# Altium schematic sheet Processing.SchDoc
size A4
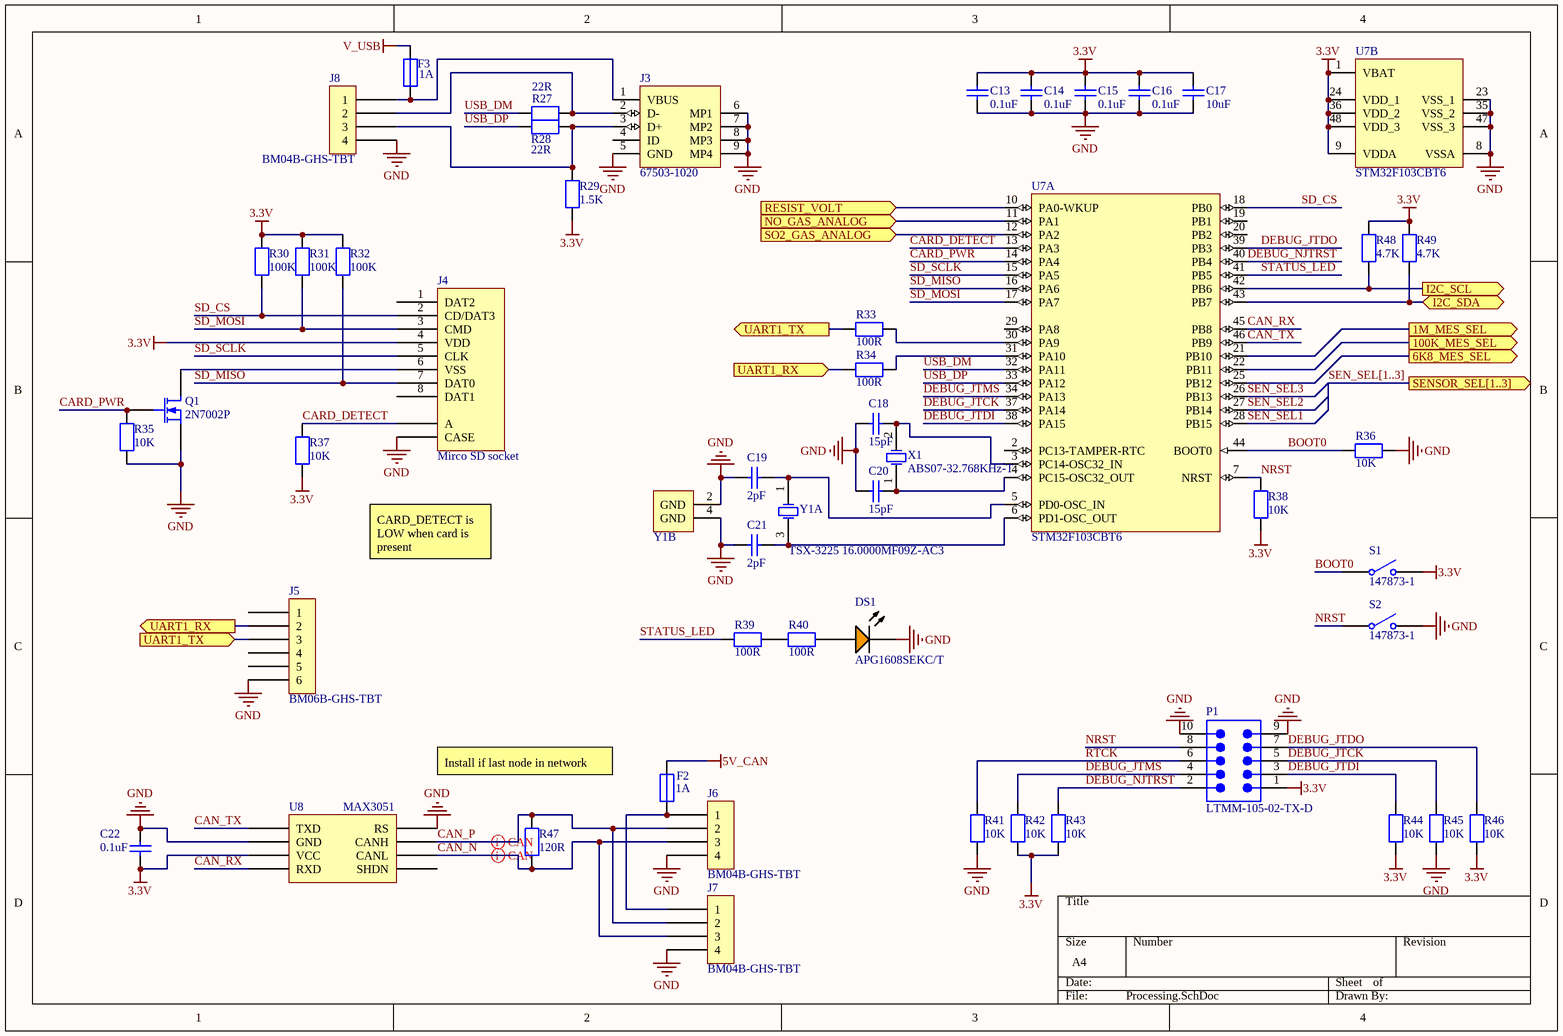
[diagram p0: Processing.SchDoc]

## Parts
C13  value 0.1uF  [0603_CAP]  (hidden comment: Capacitor)
C14  value 0.1uF  [0603_CAP]  (hidden comment: Capacitor)
C15  value 0.1uF  [0603_CAP]  (hidden comment: Capacitor)
C16  value 0.1uF  [0603_CAP]  (hidden comment: Capacitor)
C17  value 10uF  [1206_CAP]  (hidden comment: Capacitor)
C18  value 15pF  [0603_CAP]  (hidden comment: Capacitor)
C19  value 2pF  [0603_CAP]  (hidden comment: Capacitor)
C20  value 15pF  [0603_CAP]  (hidden comment: Capacitor)
C21  value 2pF  [0603_CAP]  (hidden comment: Capacitor)
C22  value 0.1uF  [0603_CAP]  (hidden comment: Capacitor)
DS1  APG1608SEKC/T  [KING-LED0603-25-ORANGE_V]
F2  Max_A: 1A  [0603_RES]  (hidden comment: Fuse)
F3  Max_A: 1A  [0603_RES]  (hidden comment: Fuse)
J3  67503-1020  [MOLX-67503-1020_V]
J4  Mirco SD socket  [HRS_DM3CS-SF]
J5  BM06B-GHS-TBT  [BM06B-GHS-TBT]
J6  BM04B-GHS-TBT  [BM04B-GHS-TBT]
J7  BM04B-GHS-TBT  [BM04B-GHS-TBT]
J8  BM04B-GHS-TBT  [BM04B-GHS-TBT]
P1  LTMM-105-02-TX-D  [SMTC-LTMM-105-02-XX-D]
Q1  PartNumber: 2N7002P  [SOT95P230X110-3M]  (hidden comment: N-channel MOSFET)
R27  value 22R  [0603_RES]  (hidden comment: Resitor)
R28  value 22R  [0603_RES]  (hidden comment: Resitor)
R29  value 1.5K  [0603_RES]  (hidden comment: Resitor)
R30  value 100K  [0603_RES]  (hidden comment: Resitor)
R31  value 100K  [0603_RES]  (hidden comment: Resitor)
R32  value 100K  [0603_RES]  (hidden comment: Resitor)
R33  value 100R  [0603_RES]  (hidden comment: Resitor)
R34  value 100R  [0603_RES]  (hidden comment: Resitor)
R35  value 10K  [0603_RES]  (hidden comment: Resitor)
R36  value 10K  [0603_RES]  (hidden comment: Resitor)
R37  value 10K  [0603_RES]  (hidden comment: Resitor)
R38  value 10K  [0603_RES]  (hidden comment: Resitor)
R39  value 100R  [0603_RES]  (hidden comment: Resitor)
R40  value 100R  [0603_RES]  (hidden comment: Resitor)
R41  value 10K  [0603_RES]  (hidden comment: Resitor)
R42  value 10K  [0603_RES]  (hidden comment: Resitor)
R43  value 10K  [0603_RES]  (hidden comment: Resitor)
R44  value 10K  [0603_RES]  (hidden comment: Resitor)
R45  value 10K  [0603_RES]  (hidden comment: Resitor)
R46  value 10K  [0603_RES]  (hidden comment: Resitor)
R47  value 120R  [0603_RES]  (hidden comment: Resitor)
R48  value 4.7K  [0603_RES]  (hidden comment: Resitor)
R49  value 4.7K  [0603_RES]  (hidden comment: Resitor)
S1  147873-1  [147873-1]
S2  147873-1  [147873-1]
U7  STM32F103CBT6  [STM-LQFP48_L]  (parts A,B of 2)
U8  MAX3051  [SOIC127P600X175-8M]
X1  ABS07-32.768KHz-T  [ABRA-ABS07-2_V]
Y1  TSX-3225 16.0000MF09Z-AC3  [TSX-3225]  (parts A,B of 2)

## Ports
1M_MES_SEL (out), 6K8_MES_SEL (out), 100K_MES_SEL (out), I2C_SCL (out), I2C_SDA (bidir), NO_GAS_ANALOG (in), RESIST_VOLT (in), SENSOR_SEL[1..3] (out), SO2_GAS_ANALOG (in), UART1_RX (in), UART1_RX (out), UART1_TX (in), UART1_TX (out)

## Nets
3.3V: C13.2 C14.2 C15.2 C16.2 C17.2 C22.1 J4.4(VDD) P1.1 R29.1 R30.2 R31.2 R32.2 R37.2 R38.1 R42.1 R43.2 R44.2 R46.1 R48.2 R49.2 S1.2(NO) U7.1(VBAT) U7.9(VDDA) U7.24(VDD_1) U7.36(VDD_2) U7.48(VDD_3) U8.3(VCC)
5V_CAN: F2.2
GND: C13.1 C14.1 C15.1 C16.1 C17.1 C18.1 C19.1 C20.1 C21.1 C22.2 DS1.2(K) J3.5(GND) J3.6(MP1) J3.7(MP2) J3.8(MP3) J3.9(MP4) J4.0(CASE) J5.6 J6.4 J7.4 J8.4 P1.9 P1.10 Q1.3(S) R35.2 R36.1 R41.1 R45.2 S2.2(NO) U7.8(VSSA) U7.23(VSS_1) U7.35(VSS_2) U7.47(VSS_3) U8.2(GND) U8.8(RS) Y1.2(GND) Y1.4(GND)
V_USB: F3.2
1M_MES_SEL: U7.21(PB10) ; port 1M_MES_SEL
6K8_MES_SEL: U7.25(PB12) ; port 6K8_MES_SEL
100K_MES_SEL: U7.22(PB11) ; port 100K_MES_SEL
BOOT0: R36.2 S1.1(COMMON) U7.44(BOOT0)
CAN_N: J6.3 J7.3 R47.1 U8.6(CANL)
CAN_P: J6.2 J7.2 R47.2 U8.7(CANH)
CAN_RX: U7.45(PB8) U8.4(RXD)
CAN_TX: U7.46(PB9) U8.1(TXD)
CARD_DETECT: J4.A R37.1 U7.13(PA3)
CARD_PWR: Q1.2(G) R35.1 U7.14(PA4)
DEBUG_JTCK: P1.5 R45.1 U7.37(PA14)
DEBUG_JTDI: P1.3 R44.1 U7.38(PA15)
DEBUG_JTDO: P1.7 R46.2 U7.39(PB3)
DEBUG_JTMS: P1.4 R42.2 U7.34(PA13)
DEBUG_NJTRST: P1.2 R43.1 U7.40(PB4)
I2C_SCL: R48.1 U7.42(PB6) ; port I2C_SCL
I2C_SDA: R49.1 U7.43(PB7) ; port I2C_SDA
NO_GAS_ANALOG: U7.11(PA1) ; port NO_GAS_ANALOG
NRST: P1.8 R38.2 S2.1(COMMON) U7.7(NRST)
RESIST_VOLT: U7.10(PA0-WKUP) ; port RESIST_VOLT
RTCK: P1.6 R41.2
SD_CS: J4.2(CD/DAT3) R30.1 U7.18(PB0)
SD_MISO: J4.7(DAT0) R32.1 U7.16(PA6)
SD_MOSI: J4.3(CMD) R31.1 U7.17(PA7)
SD_SCLK: J4.5(CLK) U7.15(PA5)
SEN_SEL1: U7.28(PB15)
SEN_SEL2: U7.27(PB14)
SEN_SEL3: U7.26(PB13)
SO2_GAS_ANALOG: U7.12(PA2) ; port SO2_GAS_ANALOG
STATUS_LED: R39.1 U7.41(PB5)
UART1_RX: J5.2 R34.1 ; port UART1_RX
UART1_TX: J5.3 R33.1 ; port UART1_TX
USB_DM: R27.1 U7.32(PA11)
USB_DP: R28.1 U7.33(PA12)
NetC18_2: C18.2 U7.3(PC14-OSC32_IN) X1.2(X2)
NetC19_2: C19.2 U7.5(PD0-OSC_IN) Y1.1(X1)
NetC20_2: C20.2 U7.4(PC15-OSC32_OUT) X1.1(X1)
NetC21_2: C21.2 U7.6(PD1-OSC_OUT) Y1.3(X2)
NetDS1_1: DS1.1(A) R40.2
NetF2_1: F2.1 J6.1 J7.1
NetF3_1: F3.1 J3.1(VBUS) J8.1
NetJ3_2: J3.2(D-) J8.2 R27.2
NetJ3_3: J3.3(D+) J8.3 R28.2 R29.2
NetJ4_6: J4.6(VSS) Q1.1(D)
NetR33_2: R33.2 U7.30(PA9)
NetR34_2: R34.2 U7.31(PA10)
NetR39_2: R39.2 R40.1

Not connected (* = marked no-connect by the designer): J3 4(ID); J4 1(DAT2) 8(DAT1); J5 1 4 5; U7 2(PC13-TAMPER-RTC) 19(PB1) 20(PB2) 29(PA8); U8 5(SHDN)

## Buses and harness runs
bus SEN_SEL[1..3] = port SENSOR_SEL[1..3]

## Layout directives
differential pair: CAN_N, CAN_P

## Notes on the sheet
- CARD_DETECT is LOW when card is present
- Install if last node in network

## Library data of the parts
C13-C22 = Capacitor: Max_V: 25V
DS1 = CMP-0239-00002-1: LED, SMT, 0603(1608), 0.25mm Tthickness, Super Bright Orange; Forward Current: 30 mA; Power Dissipation: 75 mW; Reverse Voltage: 5 V; Packing: Reel; PackageDescription: 2-Pin SMT LED, 1.6 x 0.8 mm Body, 0.25mm Thickness; ComponentLink1URL: http://www.kingbrightusa.com/; PackageVersion: Rev. 4A, 12/2011; Storage Temperature: -40 to 85 degC; PartNumber: APG1608SEKC/T; Mounting Technology: Surface Mount; ComponentLink2Description: Datasheet; DatasheetVersion: Rev. 4A, 12/2011; ComponentLink2URL: http://www.kingbrightusa.com/images/catalog/SPEC/APG1608SEKC-T.pdf; PackageReference: LED0603-25-ORANGE; ComponentLink1Description: Manufacturer URL
J3 = CMP-0411-00002-1: USB, MINI, SMD, RA KME04-USBMU03A01; Manufacturer: Molex; ComponentLink1URL: http://www.molex.com/; PartNumber: 67503-1020; Mounting Technology: Surface Mount; ComponentLink1Description: Manufacturer URL; Terminal Pitch: 0.8 mm; DatasheetVersion: Rev F, 06/2009; ComponentLink2Description: Datasheet; PackageDescription: Mini USB Connector, SMT, Righer Angle; ComponentLink2URL: http://www.molex.com/pdm_docs/sd/675031020_sd.pdf; PackageReference: 67503-1020
J4 = Micro_SD
J5 = BM06B-GHS-TBT: JST GH top entry SMD connector; Supplier 1: Digi-Key; Supplier Part Number 1: 455-1582-1-ND
J6-J8 = BM04B-GHS-TBT: JST GH top entry SMD connector; Supplier 1: Farnell; Supplier Part Number 1: 1516208
P1 = CMP-1028-00010-1: Shrouded Header & Stacker, Through-Hole, Vertical, -55 to 105 degC, 2 mm Pitch, 10-Pin, Male, RoHS; Manufacturer: Samtec; Pitch: 2 mm; RoHS: True; Temperature Range: -55 to 105 degC; PackageVersion: AQ, 5/1992; DatasheetVersion: F-214; ComponentLink1Description: Manufacturer URL; ComponentLink2Description: Datasheet; ComponentLink3Description: Package Specification; Mounting Technology: Through-hole; Orientation: Vertical; ComponentLink3URL: http://www.samtec.com/documents/webfiles/cpdf/LTMM-1XX-XX-XX-D-XX-XX-MKT.pdf; PackageReference: LTMM-105-02-XX-D; PackageDescription: LTMM Assembly; ComponentLink2URL: http://d2a072wq521u33.cloudfront.net/catalog_english//LTMM.PDF; PartNumber: LTMM-105-02-TX-D; ComponentLink1URL: http://www.samtec.com
Q1 = MOSFET-N
S1 S2 = SW-SPST: Single-Pole, Single-Throw Switch; Published: 24-Mar-1999; LatestRevisionDate: 17-Jul-2002; LatestRevisionNote: Re-released for DXP Platform.; PackageReference: SPST-2; Publisher: Altium Limited; PackageDescription: Switch; 2 Leads; Supplier 1: Newark; Supplier Part Number 1: 23R8896
U7 = CMP-0237-00250-3: ARM Cortex-M3 32-bit MCU, 128 KB Flash, 20 KB Internal RAM, 37 I/Os, 48-pin LQFP, -40 to 85 degC, Tray; Supply Voltage(Vcc) min (V): 2; Operating Frequency(F) (Processor speed) (MHz): 72; A/D Converter: 2x12-bit (10 Channel); FLASH Size (Prog) (kB): 128; Internal RAM Size (kB): 20; I/Os (High Current): 37; ComponentLink2Description: Datasheet; PackageReference: LQFP48; PartNumber: STM32F103CBT6; ComponentLink1Description: Manufacturer URL; DatasheetVersion: Rev. 16; PackageVersion: Rev. 6, 06/2013; Packing: Tray; ComponentLink1URL: http://www.st.com/web/en/home.html; Mounting Technology: Surface Mount; ComponentLink3URL: http://www.st.com/st-web-ui/static/active/en/resource/technical/document/datasheet/DM00058181.pdf; PackageDescription: 48-Pin Low Profile Quad Flat Package, 7 x 7 mm Body, 0.5 mm Pitch; Core: ARM Cortex-M3; ComponentLink3Description: Package Specification; ComponentLink2URL: http://www.st.com/st-web-ui/static/active/en/resource/technical/document/datasheet/CD00161566.pdf
X1 = CMP-0447-00001-2: Crystal, 32.768 kHz, 12.5 pF, -40 to 85 degC, SMD Low Profile 3.2 x 1.5 x 0.9 mm, Tape and Reel; Manufacturer: Abracon; Q Value (Type): 30000; Operation Mode: Flexural Mode (Tuning Fork); Shunt Capacitance (C0): 0.9 to 1.2 pF; Load Capacitance (CL): 12.5 pF; Frequency Tolerance @+25degC: +/- 20 ppm; Drive Level (Type): 0.1 uW; Equivalent Series Resistance (R1): 70 Kohm; Insulation Resistance (Min): 500 Mohm; ComponentLink3URL: http://www.abracon.com/Resonators/ABS07.pdf; PackageDescription: 2-Pin Hand Drawn, Body 3.2x1.5mm, Pitch 2.5mm; Operating Temperature: -40 to 85 degC; ComponentLink2URL: http://www.abracon.com/Resonators/ABS07.pdf; PackageReference: ABS07-2; ComponentLink3Description: Package Specification; ComponentLink1Description: Manufacturer URL; DatasheetVersion: 04.03.13; Mounting Technology: Surface Mount; ComponentLink2Description: Datasheet; ComponentLink1URL: http://www.abracon.com/; PartNumber: ABS07-32.768KHz-T; Packing: Tape and Reel; Frequency: 32.768 kHz